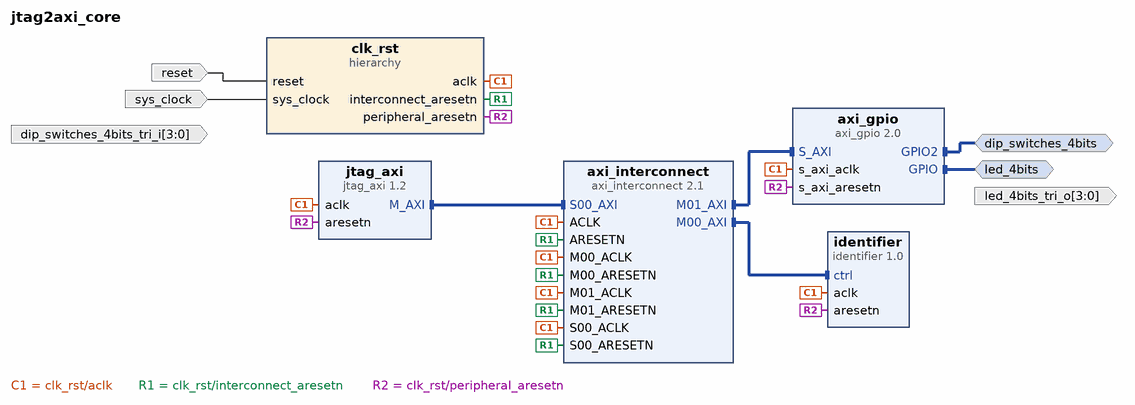
[diagram p0: block diagram of the top level]
# Vivado block design jtag2axi_core, xc7a35ticsg324-1L, Vivado 2022.2
create_bd_design jtag2axi_core

create_bd_intf_port -mode Master -vlnv xilinx.com:interface:gpio_rtl:1.0 led_4bits
create_bd_intf_port -mode Master -vlnv xilinx.com:interface:gpio_rtl:1.0 dip_switches_4bits
create_bd_port -dir I -type clk sys_clock
set_property -dict {CONFIG.FREQ_HZ 100000000 CONFIG.PHASE 0.0} [get_bd_ports sys_clock]
create_bd_port -dir I -type rst reset
set_property -dict {CONFIG.POLARITY ACTIVE_LOW} [get_bd_ports reset]
create_bd_port -dir O -from 3 -to 0 led_4bits_tri_o
create_bd_port -dir I -from 3 -to 0 dip_switches_4bits_tri_i

create_bd_cell -type ip -vlnv xilinx.com:ip:axi_gpio:2.0 axi_gpio
set_property -dict [list \
  CONFIG.GPIO2_BOARD_INTERFACE dip_switches_4bits \
  CONFIG.GPIO_BOARD_INTERFACE led_4bits \
  CONFIG.USE_BOARD_FLOW true \
] [get_bd_cells axi_gpio]
create_bd_cell -type ip -vlnv xilinx.com:ip:axi_interconnect:2.1 axi_interconnect
create_bd_cell -type hier clk_rst
create_bd_cell -type ip -vlnv xilinx.com:ip:jtag_axi:1.2 jtag_axi
create_bd_cell -type ip -vlnv lvin:versioning:identifier:1.0 identifier
set_property -dict {CONFIG.NAME JtagCom} [get_bd_cells identifier]

# ---- hierarchy /clk_rst ----
current_bd_instance /clk_rst
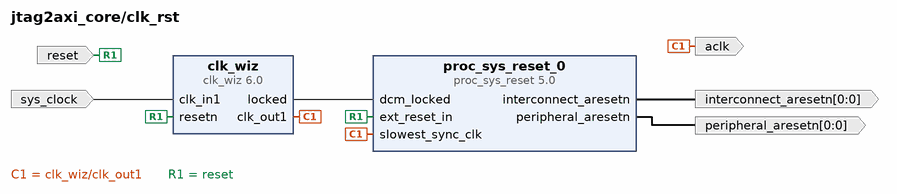
[diagram p1: block diagram inside /clk_rst]
create_bd_pin -dir I -type rst reset
create_bd_pin -dir I -type clk sys_clock
create_bd_pin -dir O -type clk aclk
create_bd_pin -dir O -from 0 -to 0 -type rst interconnect_aresetn
create_bd_pin -dir O -from 0 -to 0 -type rst peripheral_aresetn

create_bd_cell -type ip -vlnv xilinx.com:ip:clk_wiz:6.0 clk_wiz
set_property -dict [list \
  CONFIG.CLK_IN1_BOARD_INTERFACE sys_clock \
  CONFIG.RESET_BOARD_INTERFACE reset \
  CONFIG.RESET_PORT resetn \
  CONFIG.RESET_TYPE ACTIVE_LOW \
  CONFIG.USE_BOARD_FLOW true \
] [get_bd_cells clk_wiz]
create_bd_cell -type ip -vlnv xilinx.com:ip:proc_sys_reset:5.0 proc_sys_reset_0

# ---- connections ----

current_bd_instance /clk_rst
connect_bd_net [get_bd_pins clk_wiz/clk_out1] [get_bd_pins aclk] [get_bd_pins proc_sys_reset_0/slowest_sync_clk]
connect_bd_net [get_bd_pins clk_wiz/locked] [get_bd_pins proc_sys_reset_0/dcm_locked]
connect_bd_net [get_bd_pins proc_sys_reset_0/interconnect_aresetn] [get_bd_pins interconnect_aresetn]
connect_bd_net [get_bd_pins proc_sys_reset_0/peripheral_aresetn] [get_bd_pins peripheral_aresetn]
connect_bd_net [get_bd_pins reset] [get_bd_pins proc_sys_reset_0/ext_reset_in] [get_bd_pins clk_wiz/resetn]
connect_bd_net [get_bd_pins sys_clock] [get_bd_pins clk_wiz/clk_in1]

current_bd_instance /
connect_bd_intf_net -intf_net axi_gpio_0_GPIO [get_bd_intf_ports led_4bits] [get_bd_intf_pins axi_gpio/GPIO]
connect_bd_intf_net -intf_net axi_gpio_0_GPIO2 [get_bd_intf_ports dip_switches_4bits] [get_bd_intf_pins axi_gpio/GPIO2]
connect_bd_intf_net -intf_net axi_interconnect_0_M01_AXI [get_bd_intf_pins axi_interconnect/M01_AXI] [get_bd_intf_pins axi_gpio/S_AXI]
connect_bd_intf_net [get_bd_intf_pins axi_interconnect/M00_AXI] [get_bd_intf_pins identifier/ctrl]
connect_bd_intf_net -intf_net jtag_axi_0_M_AXI [get_bd_intf_pins jtag_axi/M_AXI] [get_bd_intf_pins axi_interconnect/S00_AXI]
connect_bd_net -net clk_wiz_clk_out1 [get_bd_pins clk_rst/aclk] \
  [get_bd_pins axi_gpio/s_axi_aclk] [get_bd_pins jtag_axi/aclk] [get_bd_pins axi_interconnect/ACLK] \
  [get_bd_pins axi_interconnect/S00_ACLK] [get_bd_pins axi_interconnect/M00_ACLK] [get_bd_pins axi_interconnect/M01_ACLK] \
  [get_bd_pins identifier/aclk]
connect_bd_net -net proc_sys_reset_0_interconnect_aresetn [get_bd_pins clk_rst/interconnect_aresetn] \
  [get_bd_pins axi_interconnect/ARESETN] [get_bd_pins axi_interconnect/S00_ARESETN] \
  [get_bd_pins axi_interconnect/M00_ARESETN] [get_bd_pins axi_interconnect/M01_ARESETN]
connect_bd_net -net proc_sys_reset_0_peripheral_aresetn [get_bd_pins clk_rst/peripheral_aresetn] \
  [get_bd_pins axi_gpio/s_axi_aresetn] [get_bd_pins jtag_axi/aresetn] [get_bd_pins identifier/aresetn]
connect_bd_net [get_bd_ports reset] [get_bd_pins clk_rst/reset]
connect_bd_net [get_bd_ports sys_clock] [get_bd_pins clk_rst/sys_clock]

# ---- address map ----
assign_bd_address -offset 0x40000000 -range 4K -target_address_space [get_bd_addr_spaces jtag_axi/Data] [get_bd_addr_segs identifier/ctrl/reg0]
assign_bd_address -offset 0x40001000 -range 4K -target_address_space [get_bd_addr_spaces jtag_axi/Data] [get_bd_addr_segs axi_gpio/S_AXI/Reg]

validate_bd_design
save_bd_design
